# EAGLE design DC27-bottom (EAGLE 9.4.2)

## Sheet 1 of 4
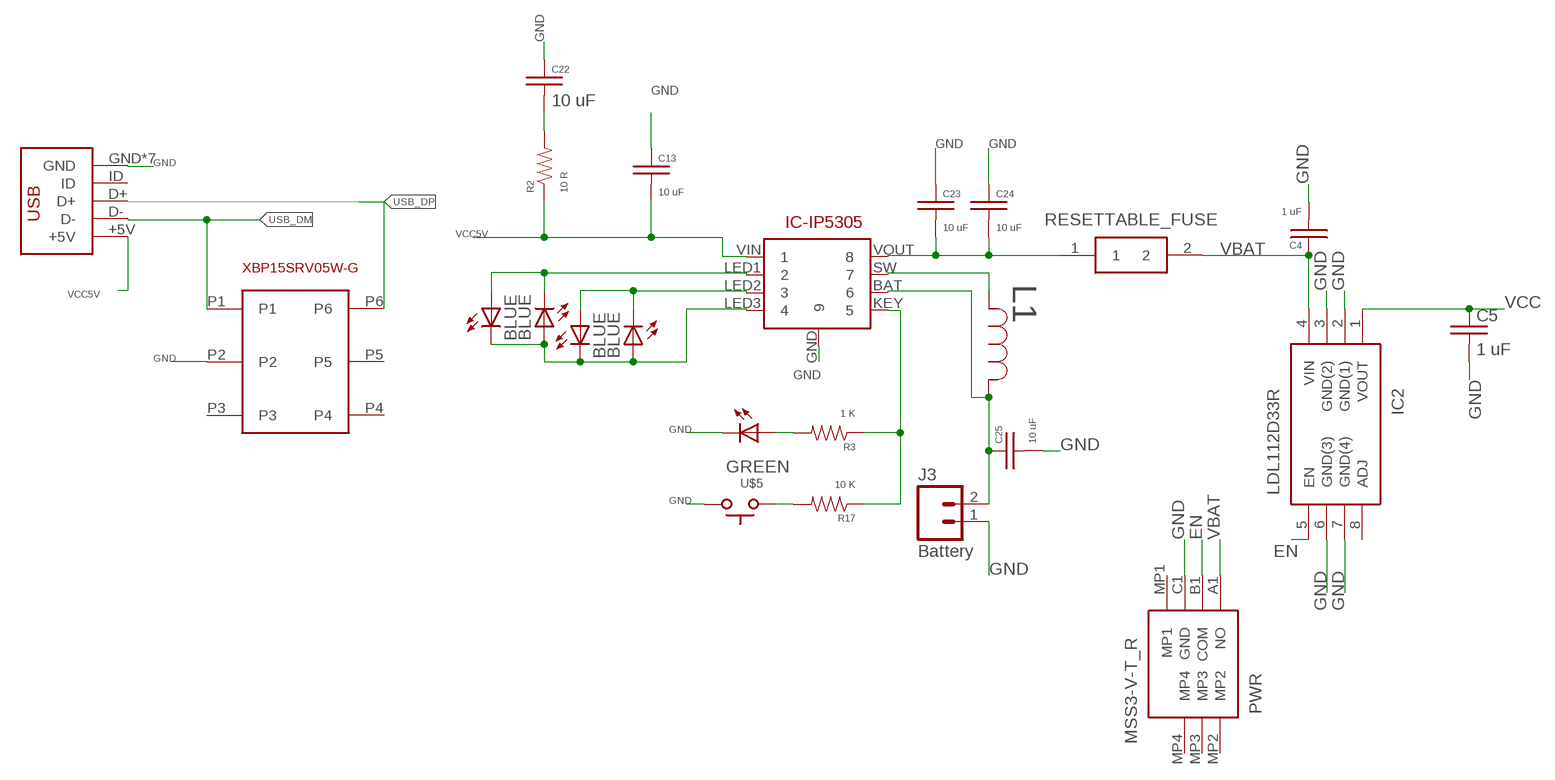
[diagram p0: schematic, sheet 1]

### Parts
C4  1 uF  C-USC0805  [C0805]
C5  1 uF  C-USC0805  [C0805]
C13  10 uF  C-USC0805  [C0805]
C22  10 uF  C-USC0805  [C0805]
C23  10 uF  C-USC0805  [C0805]
C24  10 uF  C-USC0805  [C0805]
C25  10 uF  C-USC0805  [C0805]
CL1  BLUE  LED1206  [LED-1206]
CL2  BLUE  LED1206  [LED-1206]
CL3  BLUE  LED1206  [LED-1206]
CL4  BLUE  LED1206  [LED-1206]
IC2  LDL112D33R  [SOIC127P600X175-8N]
IC-IP5305  IP5305ESOP8  [SOIC127P600X165-8]
J3  Battery  M02JST-PTH-2  [JST-2-PTH]
KEYLED  GREEN  LED1206  [LED-1206]
L1  2.2uH  NRS4018T2R2MDGJ  [IND_TAIYO_NRS4018]
PWR  MSS3-V-T_R  [MSS3VTR]
R2  10 R  RESISTOR0805-RES  [0805]
R3  1 K  RESISTOR0805-RES  [0805]
R17  10 K  RESISTOR0805-RES  [0805]
RESETTABLE_FUSE  0ZCJ0050FF2G  [FUSC3216X55N]
U$2  XBP15SRV05W-G  [SOT-26P-XBP15SRV05W-G]
U$3  DX4R005JJ2DX4R005JJ2  [DX4R005JJ2]
U$5  SWITCH_TACTILETACTILE-2PIN-NARROW  [TACTILE-2PIN-NARROW]

### Nets
EN: IC2.5(EN) PWR.B1(COM) ; also sheet 2
GND: C4.2 C5.2 C13.1 C22.1 C23.1 C24.1 C25.2 IC2.2(GND(1)) IC2.3(GND(2)) IC2.6(GND(3)) IC2.7(GND(4)) IC-IP5305.GND J3.1 KEYLED.C PWR.C1(GND) U$2.P2 U$3.GND U$3.P$6(GND) U$3.P$7(GND) U$3.P$8(GND) U$3.P$9(GND) U$3.P$10(GND) U$3.P$11(GND) U$5.P$1(A) ; also sheet 2,3
N$5: CL1.A CL2.C IC-IP5305.LED1
N$14: CL3.A CL4.C IC-IP5305.LED2
N$15: CL1.C CL2.A CL3.C CL4.A IC-IP5305.LED3
N$16: C22.2 R2.2
N$17: IC-IP5305.SW L1.2
N$20: C25.1 IC-IP5305.BAT J3.2 L1.1
N$21: IC-IP5305.KEY R3.1 R17.1
N$24: KEYLED.A R3.2
N$25: R17.2 U$5.P$2(C)
N$27: C23.2 C24.2 IC-IP5305.VOUT RESETTABLE_FUSE.1
USB_DM: U$2.P1 U$3.D- ; also sheet 3
USB_DP: U$2.P6 U$3.D+ ; also sheet 3
VBAT [5v]: C4.1 IC2.4(VIN) PWR.A1(NO) RESETTABLE_FUSE.2
VCC: C5.1 IC2.1(VOUT) ; also sheet 2,3
VCC5V [5v]: C13.2 IC-IP5305.VIN R2.1 U$3.+5V ; also sheet 3
Unconnected: IC2.8(ADJ) PWR.MP1 PWR.MP2 PWR.MP3 PWR.MP4 U$2.P3 U$2.P4 U$2.P5 U$3.ID

## Sheet 2 of 4
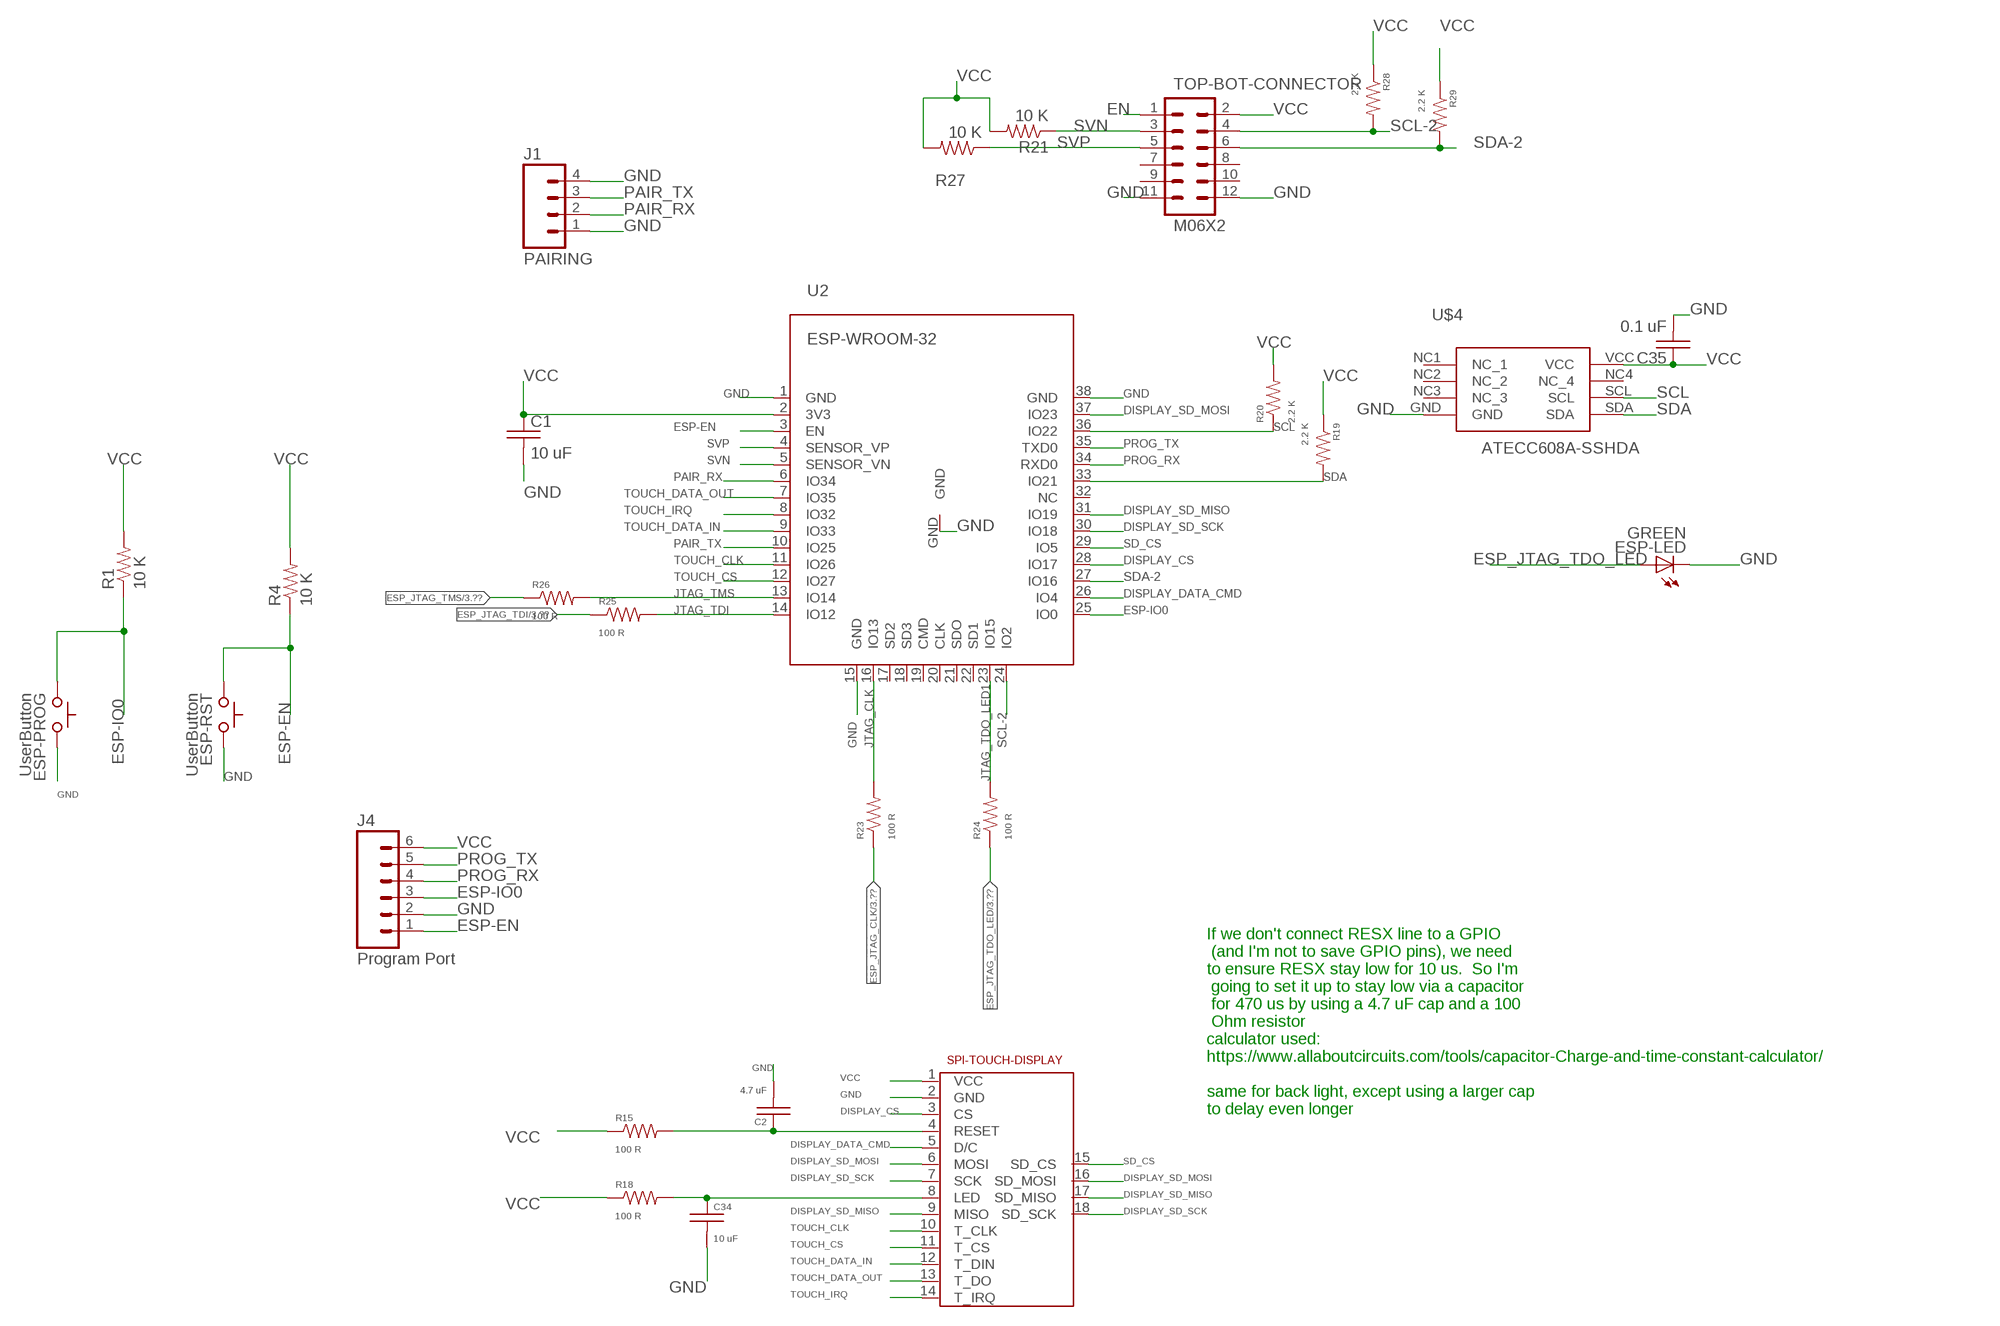
[diagram p1: schematic, sheet 2]

### Parts
C1  10 uF  C-USC0805  [C0805]
C2  4.7 uF  C-USC0805  [C0805]
C34  10 uF  C-USC0805  [C0805]
C35  0.1 uF  C-USC0805  [C0805]
ESP-LED  GREEN  LED1206  [LED-1206]
ESP-PROG  UserButton  SWITCH_TACTILETACTILE-2PIN-NARROW  [TACTILE-2PIN-NARROW]
ESP-RST  UserButton  SWITCH_TACTILETACTILE-2PIN-NARROW  [TACTILE-2PIN-NARROW]
J1  PAIRING  M04PTH  [1X04]
J4  Program Port  M06POGO-PIN  [1X06-SMD-POGO]
R1  10 K  RESISTOR0805-RES  [0805]
R4  10 K  RESISTOR0805-RES  [0805]
R15  100 R  RESISTOR0805-RES  [0805]
R18  100 R  RESISTOR0805-RES  [0805]
R19  2.2 K  RESISTOR0805-RES  [0805]
R20  2.2 K  RESISTOR0805-RES  [0805]
R21  10 K  RESISTOR0805-RES  [0805]
R23  100 R  RESISTOR0805-RES  [0805]
R24  100 R  RESISTOR0805-RES  [0805]
R25  100 R  RESISTOR0805-RES  [0805]
R26  100 R  RESISTOR0805-RES  [0805]
R27  10 K  RESISTOR0805-RES  [0805]
R28  2.2 K  RESISTOR0805-RES  [0805]
R29  2.2 K  RESISTOR0805-RES  [0805]
TOP-BOT-CONNECTOR  M06X2  [2X6]
U2  ESP-WROOM-32  [ESP-WROOM-32]
U$4  ATECC608A-SSHDA  [8-SOIC]
U$10  2.4-SPI-TFT-TOUCH-SSD-MODULE  [2.4-SPI-TFT-TOUCH-SSD-MODULE]

### Nets
DISPLAY_BACKLIT: C34.1 R18.2 U$10.8(LED)
DISPLAY_CS: U2.28(IO17) U$10.3(CS)
DISPLAY_DATA_CMD: U2.26(IO4) U$10.5(D/C)
DISPLAY_RESET: C2.1 R15.2 U$10.4(RESET)
DISPLAY_SD_MISO: U2.31(IO19) U$10.9(MISO) U$10.17(SD_MISO)
DISPLAY_SD_MOSI: U2.37(IO23) U$10.6(MOSI) U$10.16(SD_MOSI)
DISPLAY_SD_SCK: U2.30(IO18) U$10.7(SCK) U$10.18(SD_SCK)
EN: TOP-BOT-CONNECTOR.1 ; also sheet 1
ESP-EN: ESP-RST.P$2(C) J4.1 R4.1 U2.3(EN)
ESP-IO0: ESP-PROG.P$2(C) J4.3 R1.1 U2.25(IO0)
ESP_JTAG_CLK: R23.1 ; also sheet 3
ESP_JTAG_TDI: R25.1 ; also sheet 3
ESP_JTAG_TDO_LED: ESP-LED.A R24.1 ; also sheet 3
ESP_JTAG_TMS: R26.1 ; also sheet 3
GND: C1.2 C2.2 C34.2 C35.2 ESP-LED.C ESP-PROG.P$1(A) ESP-RST.P$1(A) J1.1 J1.4 J4.2 TOP-BOT-CONNECTOR.11 TOP-BOT-CONNECTOR.12 U2.1(GND) U2.15(GND) U2.38(GND) U2.GND U$4.GND U$10.2(GND) ; also sheet 1,3
JTAG_CLK: R23.2 U2.16(IO13)
JTAG_TDI: R25.2 U2.14(IO12)
JTAG_TDO_LED1: R24.2 U2.23(IO15)
JTAG_TMS: R26.2 U2.13(IO14)
PAIR_RX: J1.2 U2.6(IO34)
PAIR_TX: J1.3 U2.10(IO25)
PROG_RX: J4.4 U2.34(RXD0) ; also sheet 3
PROG_TX: J4.5 U2.35(TXD0) ; also sheet 3
SCL: R20.1 U2.36(IO22) U$4.SCL
SCL-2: R28.2 TOP-BOT-CONNECTOR.4 U2.24(IO2)
SD_CS: U2.29(IO5) U$10.15(SD_CS)
SDA: R19.2 U2.33(IO21) U$4.SDA
SDA-2: R29.2 TOP-BOT-CONNECTOR.6 U2.27(IO16)
SVN: R21.1 TOP-BOT-CONNECTOR.3 U2.5(SENSOR_VN)
SVP: R27.1 TOP-BOT-CONNECTOR.5 U2.4(SENSOR_VP)
TOUCH_CLK: U2.11(IO26) U$10.10(T_CLK)
TOUCH_CS: U2.12(IO27) U$10.11(T_CS)
TOUCH_DATA_IN: U2.9(IO33) U$10.12(T_DIN)
TOUCH_DATA_OUT: U2.7(IO35) U$10.13(T_DO)
TOUCH_IRQ: U2.8(IO32) U$10.14(T_IRQ)
VCC: C1.1 C35.1 J4.6 R1.2 R4.2 R15.1 R18.1 R19.1 R20.2 R21.2 R27.2 R28.1 R29.1 TOP-BOT-CONNECTOR.2 U2.2(3V3) U$4.VCC U$10.1(VCC) ; also sheet 1,3
Unconnected: TOP-BOT-CONNECTOR.7 TOP-BOT-CONNECTOR.8 TOP-BOT-CONNECTOR.9 TOP-BOT-CONNECTOR.10 U2.17(SD2) U2.18(SD3) U2.19(CMD) U2.20(CLK) U2.21(SDO) U2.22(SD1) U2.32(NC) U$4.NC1(NC_1) U$4.NC2(NC_2) U$4.NC3(NC_3) U$4.NC4(NC_4)

### Notes on the sheet
- If we don't connect RESX line to a GPIO
   (and I'm not to save GPIO pins), we need 
  to ensure RESX stay low for 10 us.  So I'm
   going to set it up to stay low via a capacitor
   for 470 us by using a 4.7 uF cap and a 100
   Ohm resistor
  calculator used:
  https://www.allaboutcircuits.com/tools/capacitor-Charge-and-time-constant-calculator/
  
  same for back light, except using a larger cap 
  to delay even longer

## Sheet 3 of 4
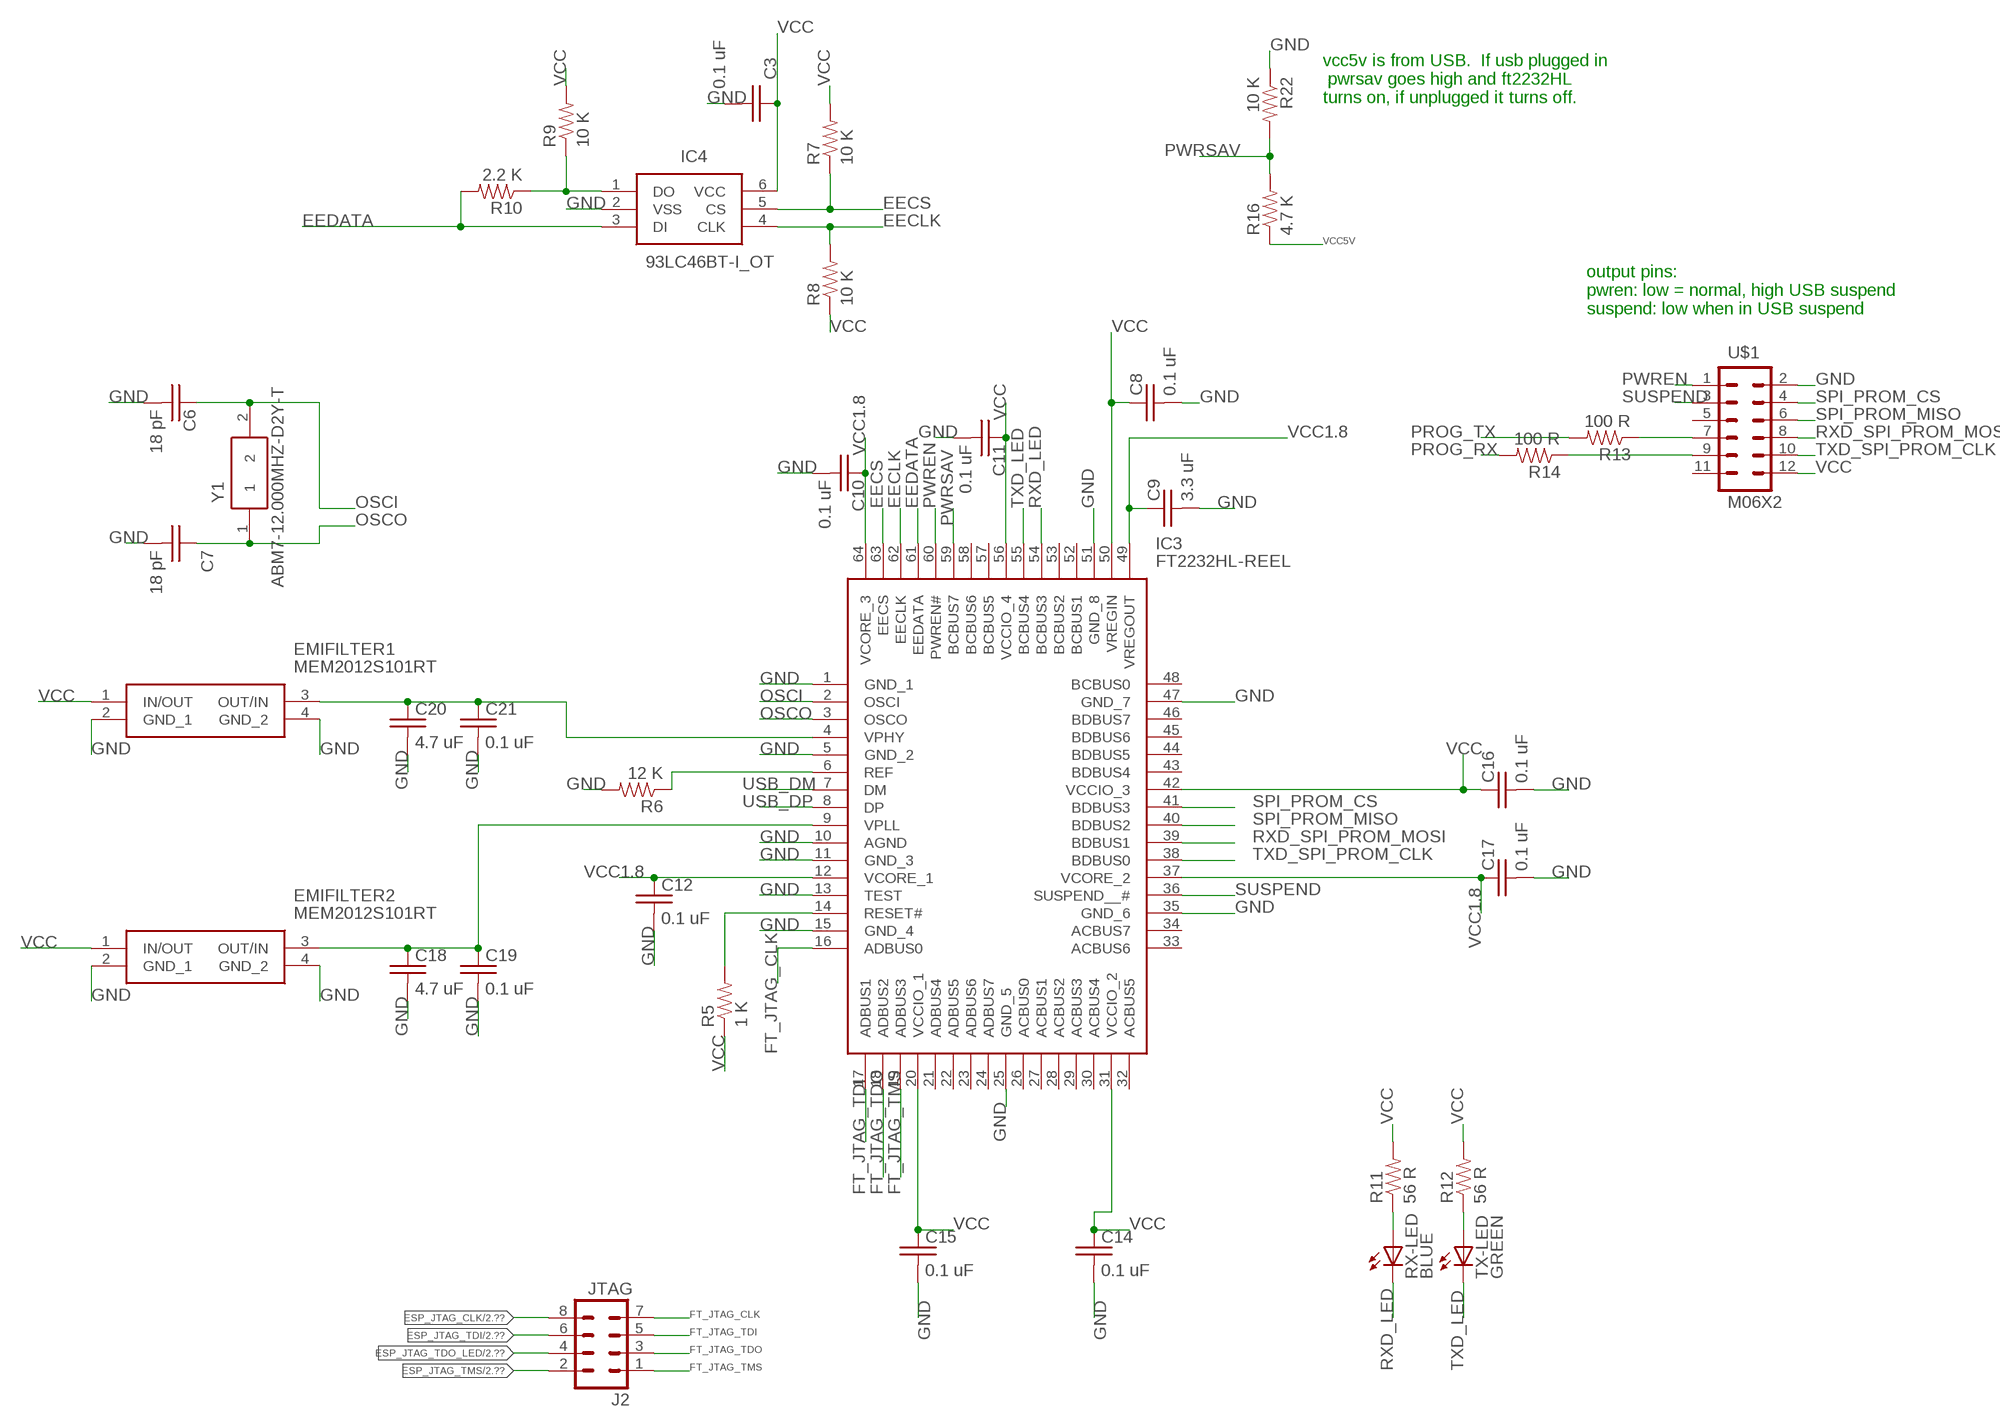
[diagram p2: schematic, sheet 3]

### Parts
C3  0.1 uF  C-USC0805  [C0805]
C6  18 pF  C-USC0805  [C0805]
C7  18 pF  C-USC0805  [C0805]
C8  0.1 uF  C-USC0805  [C0805]
C9  3.3 uF  C-USC0805  [C0805]
C10  0.1 uF  C-USC0805  [C0805]
C11  0.1 uF  C-USC0805  [C0805]
C12  0.1 uF  C-USC0805  [C0805]
C14  0.1 uF  C-USC0805  [C0805]
C15  0.1 uF  C-USC0805  [C0805]
C16  0.1 uF  C-USC0805  [C0805]
C17  0.1 uF  C-USC0805  [C0805]
C18  4.7 uF  C-USC0805  [C0805]
C19  0.1 uF  C-USC0805  [C0805]
C20  4.7 uF  C-USC0805  [C0805]
C21  0.1 uF  C-USC0805  [C0805]
EMIFILTER1  MEM2012S101RT  [MEM2012S101RT]
EMIFILTER2  MEM2012S101RT  [MEM2012S101RT]
IC3  FT2232HL-REEL  [QFP50P1200X1200X160-64N]
IC4  93LC46BT-I_OT  [SOT95P270X145-6N]
J2  JTAG  M04X2  [2X4]
R5  1 K  RESISTOR0805-RES  [0805]
R6  12 K  RESISTOR0805-RES  [0805]
R7  10 K  RESISTOR0805-RES  [0805]
R8  10 K  RESISTOR0805-RES  [0805]
R9  10 K  RESISTOR0805-RES  [0805]
R10  2.2 K  RESISTOR0805-RES  [0805]
R11  56 R  RESISTOR0805-RES  [0805]
R12  56 R  RESISTOR0805-RES  [0805]
R13  100 R  RESISTOR0805-RES  [0805]
R14  100 R  RESISTOR0805-RES  [0805]
R16  4.7 K  RESISTOR0805-RES  [0805]
R22  10 K  RESISTOR0805-RES  [0805]
RX-LED  BLUE  LED1206  [LED-1206]
TX-LED  GREEN  LED1206  [LED-1206]
U$1  M06X2  [2X6]
Y1  ABM7-12.000MHZ-D2Y-T  [ABM7]

### Nets
EECLK: IC3.62(EECLK) IC4.4(CLK) R8.2
EECS: IC3.63(EECS) IC4.5(CS) R7.1
EEDATA: IC3.61(EEDATA) IC4.3(DI) R10.2
ESP_JTAG_CLK: J2.8 ; also sheet 2
ESP_JTAG_TDI: J2.6 ; also sheet 2
ESP_JTAG_TDO_LED: J2.4 ; also sheet 2
ESP_JTAG_TMS: J2.2 ; also sheet 2
FT_JTAG_CLK: IC3.16(ADBUS0) J2.7
FT_JTAG_TDI: IC3.17(ADBUS1) J2.5
FT_JTAG_TDO: IC3.18(ADBUS2) J2.3
FT_JTAG_TMS: IC3.19(ADBUS3) J2.1
GND: C3.2 C6.2 C7.2 C8.2 C9.2 C10.2 C11.2 C12.2 C14.2 C15.2 C16.2 C17.2 C18.2 C19.2 C20.2 C21.2 EMIFILTER1.2(GND_1) EMIFILTER1.4(GND_2) EMIFILTER2.2(GND_1) EMIFILTER2.4(GND_2) IC3.1(GND_1) IC3.5(GND_2) IC3.10(AGND) IC3.11(GND_3) IC3.13(TEST) IC3.15(GND_4) IC3.25(GND_5) IC3.35(GND_6) IC3.47(GND_7) IC3.51(GND_8) IC4.2(VSS) R6.2 R22.1 U$1.2 ; also sheet 1,2
N$6: IC3.14(RESET#) R5.2
N$7: IC3.6(REF) R6.1
N$8: IC4.1(DO) R9.1 R10.1
N$11: R11.1 RX-LED.A
N$13: R12.1 TX-LED.A
N$18: C18.1 C19.1 EMIFILTER2.3(OUT/IN) IC3.9(VPLL)
N$19: C20.1 C21.1 EMIFILTER1.3(OUT/IN) IC3.4(VPHY)
N$31: R14.1 U$1.9
N$32: R13.1 U$1.7
OSCI: C6.1 IC3.2(OSCI) Y1.2
OSCO: C7.1 IC3.3(OSCO) Y1.1
PROG_RX: R14.2 ; also sheet 2
PROG_TX: R13.2 ; also sheet 2
PWREN: IC3.60(PWREN#) U$1.1
PWRSAV: IC3.59(BCBUS7) R16.2 R22.2
RXD_LED: IC3.54(BCBUS3) RX-LED.C
RXD_SPI_PROM_MOSI: IC3.39(BDBUS1) U$1.8
SPI_PROM_CS: IC3.41(BDBUS3) U$1.4
SPI_PROM_MISO: IC3.40(BDBUS2) U$1.6
SUSPEND: IC3.36(SUSPEND__#) U$1.3
TXD_LED: IC3.55(BCBUS4) TX-LED.C
TXD_SPI_PROM_CLK: IC3.38(BDBUS0) U$1.10
USB_DM: IC3.7(DM) ; also sheet 1
USB_DP: IC3.8(DP) ; also sheet 1
VCC: C3.1 C8.1 C11.1 C14.1 C15.1 C16.1 EMIFILTER1.1(IN/OUT) EMIFILTER2.1(IN/OUT) IC3.20(VCCIO_1) IC3.31(VCCIO_2) IC3.42(VCCIO_3) IC3.50(VREGIN) IC3.56(VCCIO_4) IC4.6(VCC) R5.1 R7.2 R8.1 R9.2 R11.2 R12.2 U$1.12 ; also sheet 1,2
VCC1.8: C9.1 C10.1 C12.1 C17.1 IC3.12(VCORE_1) IC3.37(VCORE_2) IC3.49(VREGOUT) IC3.64(VCORE_3)
VCC5V [5v]: R16.1 ; also sheet 1
Unconnected: IC3.21(ADBUS4) IC3.22(ADBUS5) IC3.23(ADBUS6) IC3.24(ADBUS7) IC3.26(ACBUS0) IC3.27(ACBUS1) IC3.28(ACBUS2) IC3.29(ACBUS3) IC3.30(ACBUS4) IC3.32(ACBUS5) IC3.33(ACBUS6) IC3.34(ACBUS7) IC3.43(BDBUS4) IC3.44(BDBUS5) IC3.45(BDBUS6) IC3.46(BDBUS7) IC3.48(BCBUS0) IC3.52(BCBUS1) IC3.53(BCBUS2) IC3.57(BCBUS5) IC3.58(BCBUS6) U$1.5 U$1.11

### Notes on the sheet
- vcc5v is from USB.  If usb plugged in
   pwrsav goes high and ft2232HL 
  turns on, if unplugged it turns off.
- output pins:
  pwren: low = normal, high USB suspend
  suspend: low when in USB suspend

## Sheet 4 of 4
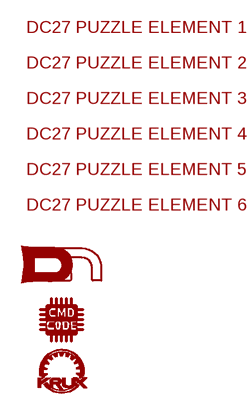
[diagram p3: schematic, sheet 4]

### Parts
U$6  DC27_PUZZLE_ELEMENT_1  [DC27_PUZZLE_ELEMENT_1]
U$7  KRUX_LOGO  [KRUX_LOGO]
U$8  CMD_C0DE_LOGO  [CMD_C0DE_LOGO]
U$9  DN_LOGODC26  [DN_LOGO_DC26]
U$11  DC27_PUZZLE_ELEMENT_2  [DC27_PUZZLE_ELEMENT_2]
U$12  DC27_PUZZLE_ELEMENT_3  [DC27_PUZZLE_ELEMENT_3]
U$13  DC27_PUZZLE_ELEMENT_4  [DC27_PUZZLE_ELEMENT_4]
U$14  DC27_PUZZLE_ELEMENT_5  [DC27_PUZZLE_ELEMENT_5]
U$15  DC27_PUZZLE_ELEMENT_6  [DC27_PUZZLE_ELEMENT_6]

## Library data of the parts
C1-C25 C34 C35 = passives:C-US: CAPACITOR, American symbol
CL1-CL4 ESP-LED KEYLED RX-LED TX-LED = leds:LED: LEDs Standard schematic elements and footprints for 5mm, 3mm, 1206, and 0603 sized LEDs. 5mm - Spark Fun Electronics SKU : COM-00529 (and others)
EMIFILTER1 EMIFILTER2 = passives:MEM2012S101RT: EMI Filter Circuits Source: Datasheet; DESCRIPTION: EMI Filter Circuits; HEIGHT: 1mm; MANUFACTURER_NAME: TDK; MANUFACTURER_PART_NUMBER: MEM2012S101RT; MOUSER_PART_NUMBER: N/A
ESP-PROG ESP-RST = dc-26:SWITCH_TACTILE
IC2 = voltage-regulator:LDL112D33R: LDO Voltage Regulators 1.2 A low quiescent current LDO with reverse current protection Source: Datasheet; ARROW_PART_NUMBER: LDL112D33R; ARROW_PRICE/STOCK: https://www.arrow.com/en/products/ldl112d33r/stmicroelectronics; DESCRIPTION: LDO Voltage Regulators 1.2 A low quiescent current LDO with reverse current protection; HEIGHT: 1.75mm; MANUFACTURER_NAME: STMicroelectronics; MANUFACTURER_PART_NUMBER: LDL112D33R
IC3 = ICs:FT2232HL-REEL: FTDI Chip FT2232HL-REEL, USB Controller, 4-channel, 480MBps, USB 2.0, 64-Pin LQFP Source: Datasheet; DESCRIPTION: FTDI Chip FT2232HL-REEL, USB Controller, 4-channel, 480MBps, USB 2.0, 64-Pin LQFP; HEIGHT: 1.6mm; MANUFACTURER_NAME: FTDI Chip; MANUFACTURER_PART_NUMBER: FT2232HL-REEL; MOUSER_PART_NUMBER: 895-FT2232HL
IC4 = eeprom:93LC46BT-I_OT: 1K,64 X 16 Serial EE,SOT23 Source: Datasheet; DESCRIPTION: 1K,64 X 16 Serial EE,SOT23; HEIGHT: 1.45mm; MANUFACTURER_NAME: Microchip; MANUFACTURER_PART_NUMBER: 93LC46BT-I/OT; MOUSER_PART_NUMBER: 579-93LC46BT-I/OT
IC-IP5305 = charging-ic:IP5305: IP5305
J1 = connector:M04: Header 4 Standard 4-pin 0.1" header. Use with straight break away headers (SKU : PRT-00116), right angle break away headers (PRT-00553), swiss pins (PRT-00743), machine pins (PRT-00117), and female headers (PRT-00115). Molex polarized connector foot print use with SKU : PRT-08231 with associated crimp pins and housings. 1MM SMD Version SKU: PRT-10208; PROD_ID: CONN-09696
J2 = connector:M04X2: .1" header, two rows of four.
J3 = connector:M02: Standard 2-pin 0.1" header. Use with - straight break away headers ( PRT-00116) - right angle break away headers (PRT-00553) - swiss pins (PRT-00743) - machine pins (PRT-00117) - female headers (PRT-00115) Molex polarized connector foot print use with: PRT-08233 with associated crimp pins and housings. 2.54_SCREWTERM for use with PRT-10571. 3.5mm Screw Terminal footprints for PRT-08084 5mm Screw Terminal footprints for use with PRT-08432; PROD_ID: CONN-09863; SKU: PRT-09914
J4 = connector:M06: Header 6 Standard 6-pin 0.1" header. Use with straight break away headers (SKU : PRT-00116), right angle break away headers (PRT-00553), swiss pins (PRT-00743), machine pins (PRT-00117), and female headers (PRT-00115). Molex polarized connector foot print use with SKU : PRT-08094 with associated crimp pins and housings. NOTES ON THE VARIANTS LOCK and LOCK_LONGPADS... This footprint was designed to help hold the alignment of a through-hole component (i.e. 6-pin header) while soldering it into place. You may notice that each hole has been shifted either up or down by 0.005 of an inch from it's more standard position (which is a perfectly straight line). This slight alteration caused the pins (the squares in the middle) to touch the edges of the holes. Because they are alternating, it causes a "brace" to hold the component in place. 0.005 has proven to be the perfect amount of "off-center" position when using our standard breakaway headers. Although looks a little odd when you look at the bare footprint, once you have a header in there, the alteration is very hard to notice. Also,if you push a header all the way into place, it is covered up entirely on the bottom side. This idea of altering the position of holes to aid alignment will be further integrated into the Sparkfun Library for other footprints. It can help hold any component with 3 or more connection pins.
L1 = passives:NRS4018T2R2MDGJ: Inductor: CD43; MANUFACTURER_PART_NUMBER: NRS4018T2R2MDGJ; VENDOR: TAIYO YUDEN
PWR = switches:MSS3-V-T_R: Slide Switches Slide Type 1P2T (1.4mm height) Source: Datasheet; DESCRIPTION: Slide Switches Slide Type 1P2T (1.4mm height); HEIGHT: 1.4mm; MANUFACTURER_NAME: Diptronics; MANUFACTURER_PART_NUMBER: MSS3-V-T/R; MOUSER_PART_NUMBER: 113-MSS3-V-T/R; MOUSER_PRICE-STOCK: https://www.mouser.com/Search/Refine.aspx?Keyword=113-MSS3-V-T%2FR
R1 R4 R15 R18-R21 R23-R29 = dc-26:RESISTOR: Resistor Basic schematic elements and footprints for 0603, 1206, and PTH resistors.
R2 R3 R5-R14 R16 R17 R22 = passives:RESISTOR: Resistor Basic schematic elements and footprints for 0603, 1206, and PTH resistors.
RESETTABLE_FUSE = passives:0ZCJ0050FF2G: Resettable Fuses - PPTC <https://componentsearchengine.com/Images/9/0ZCJ0050FF2G.jpg> Source: Datasheet <https://www.belfuse.com/resources/CircuitProtection/datasheets/0ZCJ Nov2016.pdf>; DESCRIPTION: Resettable Fuses - PPTC; HEIGHT: 0.55mm; MANUFACTURER_NAME: Bel-Stewart; MANUFACTURER_PART_NUMBER: 0ZCJ0050FF2G; SUPPLIER_NAME: RS
TOP-BOT-CONNECTOR U$1 = connector:M06X2
U2 = ICs:ESP-WROOM-32
U$2 = passives:XBP15SRV05W-G: Low Capacitance TVS Diode Array (used for USB) P1->D- (usb1) P2->GND P3->D- (usb2) P4->D+ (usb2) P5->NC P6->D+(usb1) Datasheet; DIGI_KEY_PART_NUMBER: 893-1422-1-ND; MANUFACTURER_PART_NUMBER: XBP15SRV05W-G
U$3 = connector:DX4R005JJ2
U$4 = ICs:ATECC608A-SSHDA
U$5 = switches:SWITCH_TACTILE
U$6 = darknet_parts_library:DC27_PUZZLE_ELEMENT_1
U$7 = logos:KRUX_LOGO
U$8 = logos:CMD_C0DE_LOGO
U$9 = darknet_parts_library:DN_LOGO
U$10 = displays:2.4-SPI-TFT-TOUCH-SSD-MODULE: 2.4" SPI TFT Module Driver: ILI9341 DOTS: 240x320 Touch: YES
U$11 = darknet_parts_library:DC27_PUZZLE_ELEMENT_2
U$12 = darknet_parts_library:DC27_PUZZLE_ELEMENT_3
U$13 = darknet_parts_library:DC27_PUZZLE_ELEMENT_4
U$14 = darknet_parts_library:DC27_PUZZLE_ELEMENT_5
U$15 = darknet_parts_library:DC27_PUZZLE_ELEMENT_6
Y1 = crystals-timing:ABM7-12.000MHZ-D2Y-T: ABRACON - ABM7-12.000MHZ-D2Y-T - CRYSTAL, 12MHZ, 18PF, SMD Source: Datasheet; DESCRIPTION: ABRACON - ABM7-12.000MHZ-D2Y-T - CRYSTAL, 12MHZ, 18PF, SMD; HEIGHT: mm; MANUFACTURER_NAME: ABRACON; MANUFACTURER_PART_NUMBER: ABM7-12.000MHZ-D2Y-T; MOUSER_PART_NUMBER: 815-ABM7-12-D2Y-T; MOUSER_PRICE-STOCK: https://www.mouser.com/Search/Refine.aspx?Keyword=815-ABM7-12-D2Y-T; RS_PART_NUMBER: 1710625P; RS_PRICE-STOCK: http://uk.rs-online.com/web/p/products/1710625P

## Net classes
2 5v: width 0.254 mm, drill 0.8 mm, clearance 0.178 mm

## Board
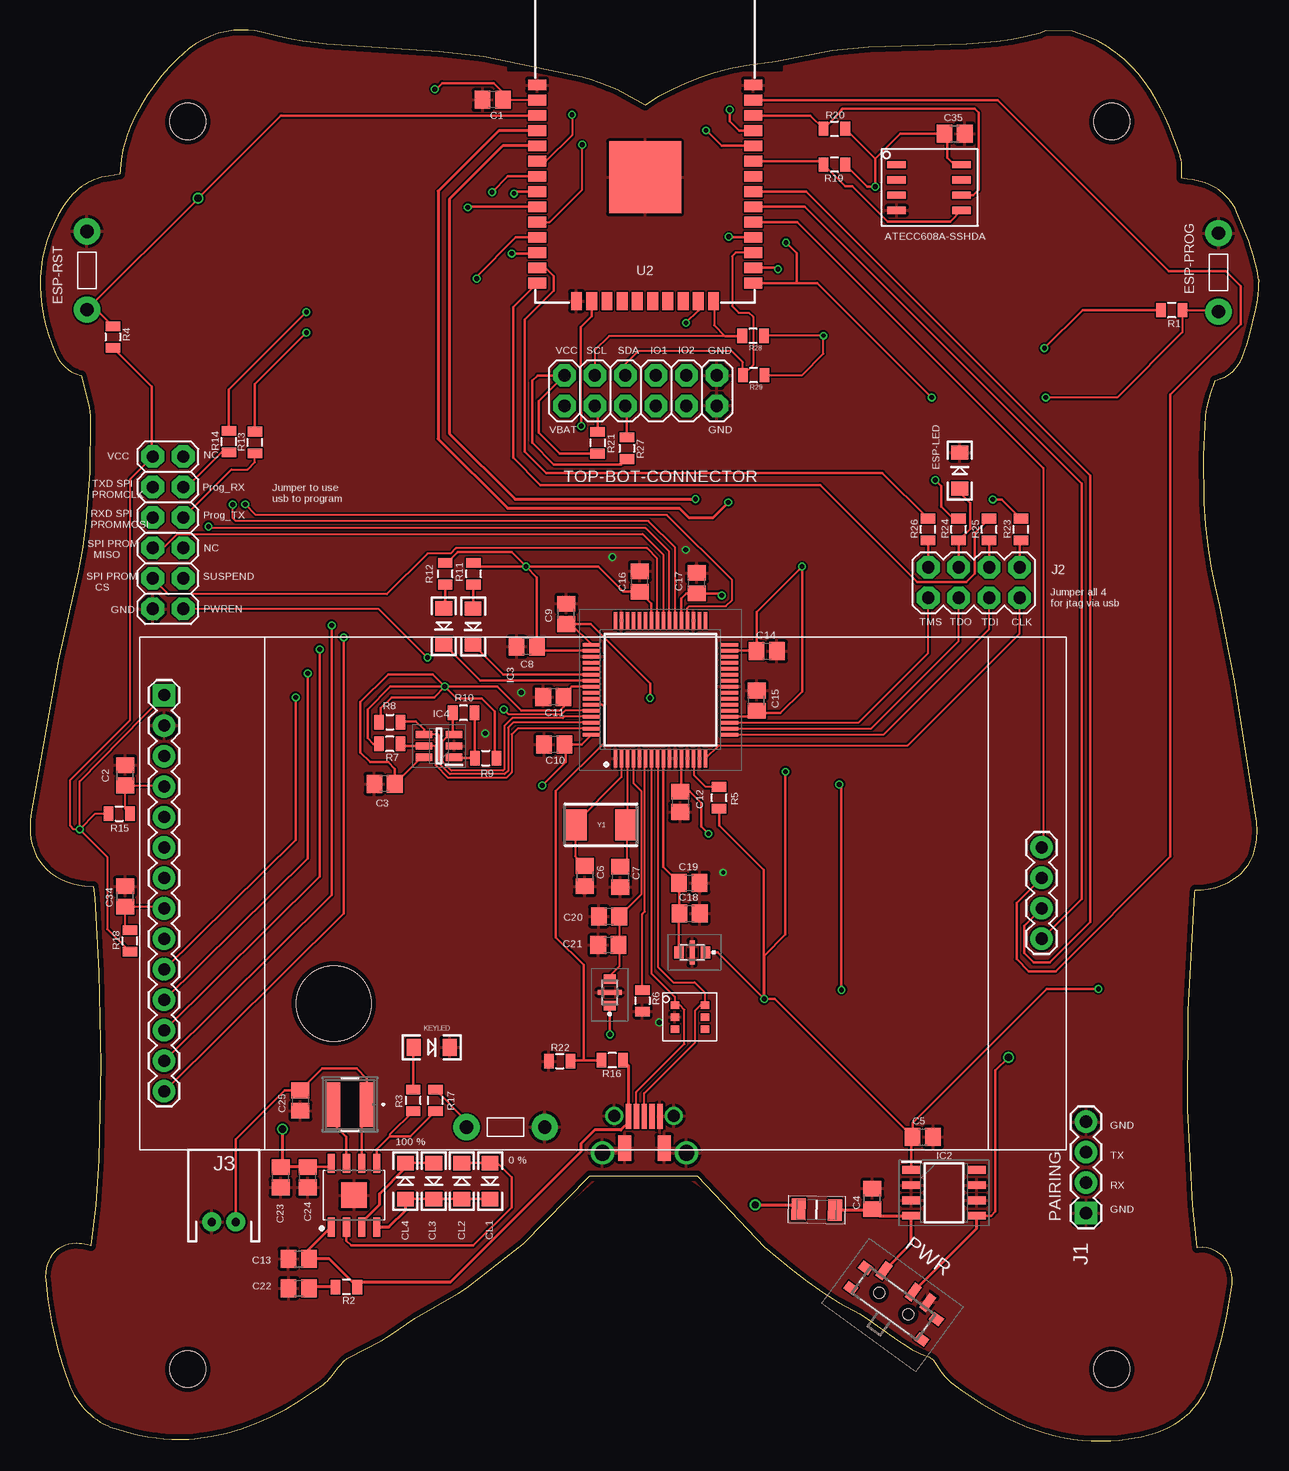
[diagram p4: board, top side]
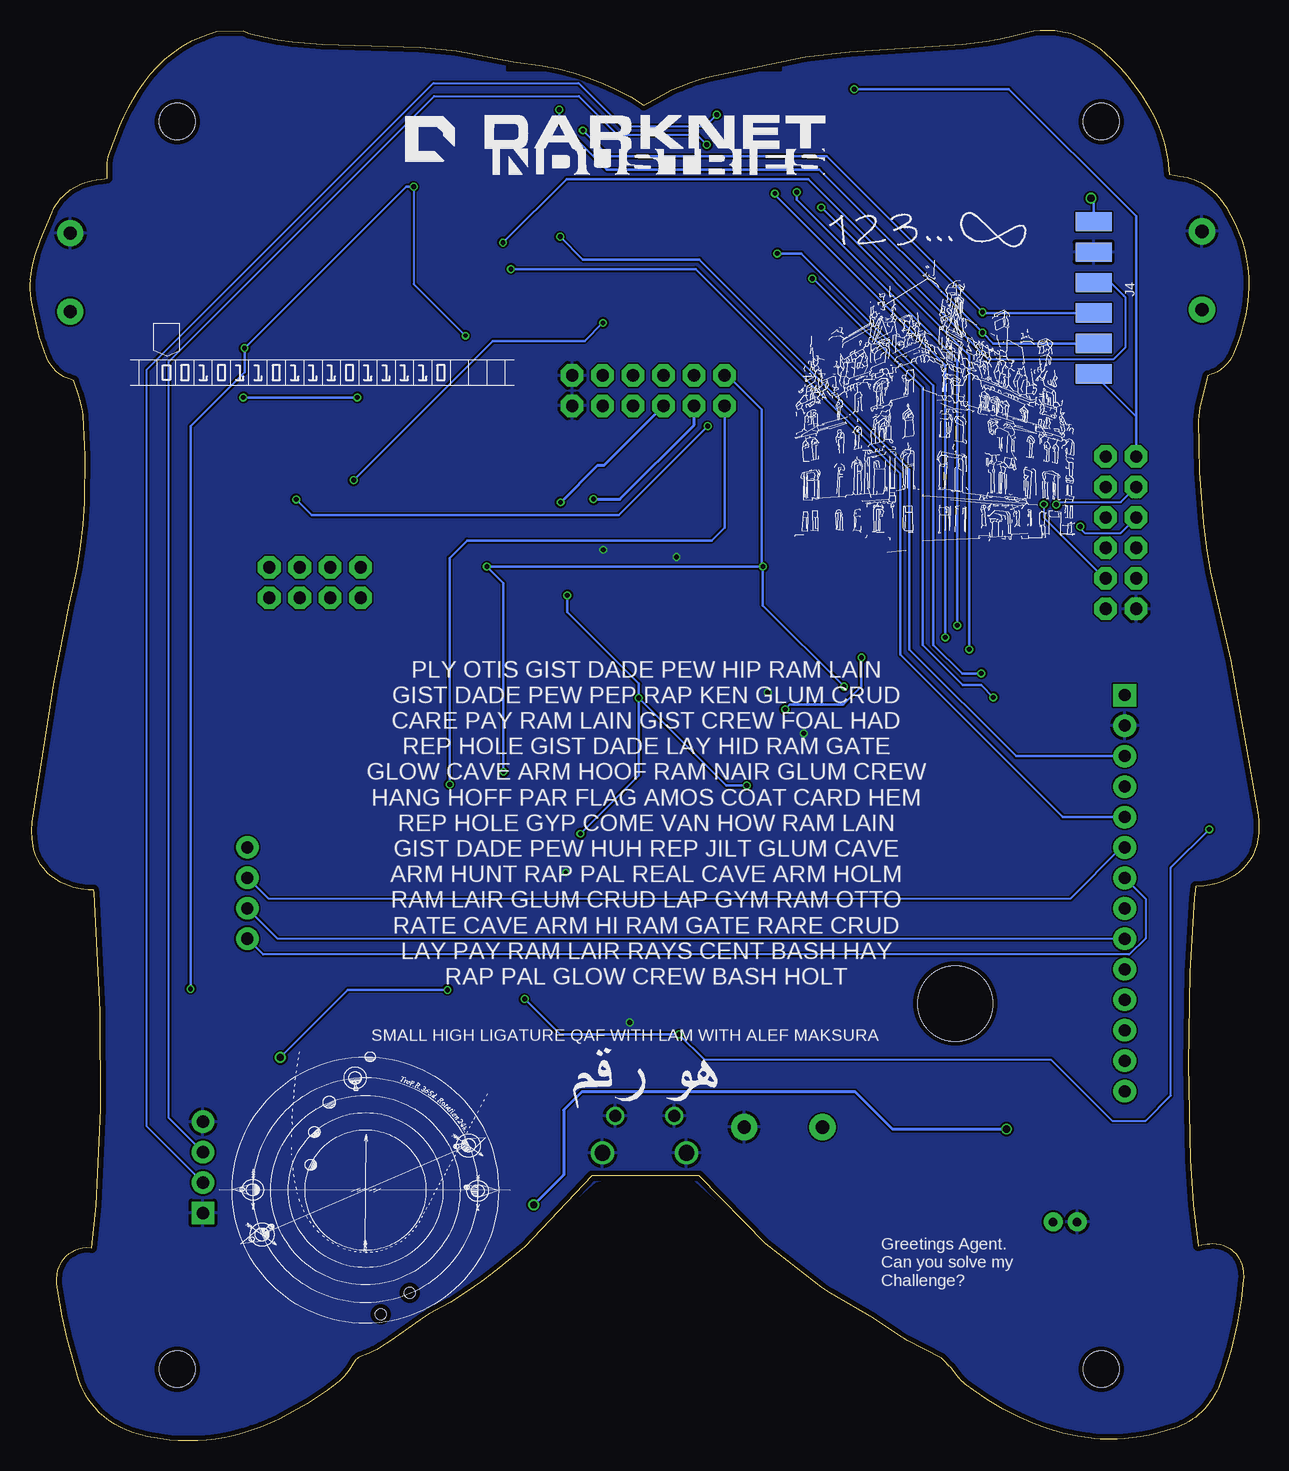
[diagram p5: board, bottom side, seen from below]

Size 102.41 x 117.62 mm. Coordinates in mm from the lower left corner, seen from the top.
Outline: 382 segments
Copper layers (1*16): Top 0.035559375mm / dielectric 1.6mm / Bottom 0.035559375mm
Design rules "oshpark-2layer": minimum track width 6mil, minimum drill 10mil, track to track 6mil, track to pad 6mil, pad to pad 6mil, via to via 6mil, smd to smd 6mil, copper to edge 15mil, drill to drill 6mil, minimum pad ring 5mil, minimum via ring 5mil, stop-mask expansion 2.5mil, vias tented up to drill 0mil, thermal gap 10mil
Holes 3 mm at 13.13,5.99 90.13,5.99 90.13,109.99 13.13,109.99
Holes 6.25 mm at 25.31,36.46

### Footprints (pad centres in the part's own frame; a part is rotated, then mirrored left to right if it is on the bottom)
C0805 = smd 1.3 x 1.5: 1 -0.85,0; 2 0.85,0
LED-1206 = smd 1.2 x 1.4: A -1.5,0; C 1.5,0
MEM2012S101RT = smd 0.8 x 1: 1 -1.1,0; 3 1.1,0 | smd 0.4 x 1: 2 0,-0.5; 4 0,0.5
TACTILE-2PIN-NARROW = drill 1.1 pad 2.184: P$1 3.264,0; P$2 -3.264,0
SOIC127P600X175-8N = smd 1.525 x 0.65: 1 -2.712,1.905; 2 -2.712,0.635; 3 -2.712,-0.635; 4 -2.712,-1.905; 5 2.712,-1.905; 6 2.712,-0.635; 7 2.712,0.635; 8 2.712,1.905
QFP50P1200X1200X160-64N = smd 1.475 x 0.3: 1 -5.738,3.75; 2 -5.738,3.25; 3 -5.738,2.75; 4 -5.738,2.25; 5 -5.738,1.75; 6 -5.738,1.25; 7 -5.738,0.75; 8 -5.738,0.25; 9 -5.738,-0.25; 10 -5.738,-0.75; 11 -5.738,-1.25; 12 -5.738,-1.75; 13 -5.738,-2.25; 14 -5.738,-2.75; 15 -5.738,-3.25; 16 -5.738,-3.75; 33 5.738,-3.75; 34 5.738,-3.25; 35 5.738,-2.75; 36 5.738,-2.25; 37 5.738,-1.75; 38 5.738,-1.25; 39 5.738,-0.75; 40 5.738,-0.25; 41 5.738,0.25; 42 5.738,0.75; 43 5.738,1.25; 44 5.738,1.75; 45 5.738,2.25; 46 5.738,2.75; 47 5.738,3.25; 48 5.738,3.75 | smd 0.3 x 1.475: 17 -3.75,-5.738; 18 -3.25,-5.738; 19 -2.75,-5.738; 20 -2.25,-5.738; 21 -1.75,-5.738; 22 -1.25,-5.738; 23 -0.75,-5.738; 24 -0.25,-5.738; 25 0.25,-5.738; 26 0.75,-5.738; 27 1.25,-5.738; 28 1.75,-5.738; 29 2.25,-5.738; 30 2.75,-5.738; 31 3.25,-5.738; 32 3.75,-5.738; 49 3.75,5.738; 50 3.25,5.738; 51 2.75,5.738; 52 2.25,5.738; 53 1.75,5.738; 54 1.25,5.738; 55 0.75,5.738; 56 0.25,5.738; 57 -0.25,5.738; 58 -0.75,5.738; 59 -1.25,5.738; 60 -1.75,5.738; 61 -2.25,5.738; 62 -2.75,5.738; 63 -3.25,5.738; 64 -3.75,5.738
SOT95P270X145-6N = smd 1.4 x 0.6: 1 -1.25,0.95; 2 -1.25,0; 3 -1.25,-0.95; 4 1.25,-0.95; 5 1.25,0; 6 1.25,0.95
SOIC127P600X165-8 = smd 1.609 x 0.594: BAT 2.653,-0.635; KEY 2.653,-1.905; LED1 -2.653,0.635; LED2 -2.653,-0.635; LED3 -2.653,-1.905; SW 2.653,0.635; VIN -2.653,1.905; VOUT 2.653,1.905 | smd 2.15 x 2.15: GND 0,0
1X04 = drill 1.016 pad 1.88 square: 1 0,0 | drill 1.016 pad 1.88: 2 2.54,0; 3 5.08,0; 4 7.62,0
2X4 = drill 1.016 pad 1.88 octagon: 1 -3.81,-1.27; 2 -3.81,1.27; 3 -1.27,-1.27; 4 -1.27,1.27; 5 1.27,-1.27; 6 1.27,1.27; 7 3.81,-1.27; 8 3.81,1.27
JST-2-PTH = drill 0.7 pad 1.6: 1 -1,0; 2 1,0
1X06-SMD-POGO = smd 1.6 x 3: 1 -6.35,-0.08; 2 -3.81,-0.08; 3 -1.27,-0.08; 4 1.27,-0.08; 5 3.81,-0.08; 6 6.35,-0.08
IND_TAIYO_NRS4018 = smd 1.194 x 3.708: 1 -1.397,0; 2 1.397,0
MSS3VTR = smd 0.7 x 1.5: A1 -2.25,3.05; B1 0.75,3.05; C1 2.25,3.05 | smd 1 x 0.8: MP1 -3.65,2.35; MP2 -3.65,0.25; MP3 3.65,0.25; MP4 3.65,2.35 | hole 0.9: -1.5,1.3; 1.5,1.3
0805 = smd 0.8 x 1.2: 1 -0.9,0; 2 0.9,0
FUSC3216X55N = smd 1.17 x 1.82: 1 -1.52,0; 2 1.52,0
2X6 = drill 1.016 pad 1.88 octagon: 1 0,0; 2 0,2.54; 3 2.54,0; 4 2.54,2.54; 5 5.08,0; 6 5.08,2.54; 7 7.62,0; 8 7.62,2.54; 9 10.16,0; 10 10.16,2.54; 11 12.7,0; 12 12.7,2.54
ESP-WROOM-32 = smd 0.9 x 1.5: 1 7.7,9; 2 6.43,9; 3 5.16,9; 4 3.89,9; 5 2.62,9; 6 1.35,9; 7 0.08,9; 8 -1.19,9; 9 -2.46,9; 10 -3.73,9; 11 -5,9; 12 -6.27,9; 13 -7.54,9; 14 -8.81,9; 25 -8.81,-9; 26 -7.54,-9; 27 -6.27,-9; 28 -5,-9; 29 -3.73,-9; 30 -2.46,-9; 31 -1.19,-9; 32 0.08,-9; 33 1.35,-9; 34 2.62,-9; 35 3.89,-9; 36 5.16,-9; 37 6.43,-9; 38 7.7,-9 | smd 1.5 x 0.9: 15 -10.3,5.715; 16 -10.3,4.445; 17 -10.3,3.175; 18 -10.3,1.905; 19 -10.3,0.635; 20 -10.3,-0.635; 21 -10.3,-1.905; 22 -10.3,-3.175; 23 -10.3,-4.445; 24 -10.3,-5.715 | smd 6 x 6: GND 0,0
SOT-26P-XBP15SRV05W-G = smd 0.6 x 0.7: P1 -1,-1.25; P2 0,-1.25; P3 1,-1.25; P4 1,1.25; P5 0,1.25; P6 -1,1.25
DX4R005JJ2 = smd 2.1 x 0.45: +5V 0.72,-1.32; D+ 0.72,-0.02; D- 0.72,-0.67; GND 0.72,1.28; ID 0.72,0.63 | smd 2.1 x 1.1: P$6 3.35,1.65; P$8 3.35,-1.65 | drill 1: P$7 0.675,2.45; P$9 0.675,-2.5 | drill 1.3: P$10 3.75,-3.5; P$11 3.75,3.5
8-SOIC = smd 0.6 x 1.55: GND 3.81,0; NC1 0,0; NC2 1.27,0; NC3 2.54,0; NC4 1.27,5.4; SCL 2.54,5.4; SDA 3.81,5.4; VCC 0,5.4
2.4-SPI-TFT-TOUCH-SSD-MODULE = drill 1.016 pad 1.88 square: 1 4.83,2.02 | drill 1.016 pad 1.88: 2 7.37,2.02; 3 9.91,2.02; 4 12.45,2.02; 5 14.99,2.02; 6 17.53,2.02; 7 20.07,2.02; 8 22.61,2.02; 9 25.15,2.02; 10 27.69,2.02; 11 30.23,2.02; 12 32.77,2.02; 13 35.31,2.02; 14 37.85,2.02; 15 17.52,75.14; 16 20.06,75.14; 17 22.6,75.14; 18 25.14,75.14
ABM7 = smd 1.9 x 2.6: 1 -2.15,0; 2 2.15,0

### Placement (x,y rotation side)
C1  38.56,111.8 180 top
C2  7.93,55.49 90 top
C3  29.54,54.78 180 top
C4  70.2,20.19 90 top
C5  74.41,25.34 0 top
C6  46.23,47.08 270 top
C7  49.2,47.01 270 top
C8  41.4,66.22 180 top
C9  44.7,68.95 90 top
C10  43.69,58.06 180 top
C11  43.62,62.02 180 top
C12  54.19,53.29 270 top
C13  22.38,15.19 0 top
C14  61.4,65.84 0 top
C15  60.54,61.71 90 top
C16  50.82,71.65 90 top
C17  55.58,71.51 90 top
C18  54.96,43.99 0 top
C19  54.94,46.54 0 top
C20  48.26,43.73 180 top
C21  48.21,41.34 180 top
C22  22.4,12.74 0 top
C23  20.88,21.99 90 top
C24  23.13,21.99 90 top
C25  22.53,28.38 270 top
C34  7.93,45.39 90 top
C35  77.04,108.98 0 top
CL1  38.33,21.67 270 top
CL2  35.98,21.67 90 top
CL3  33.63,21.67 270 top
CL4  31.28,21.67 90 top
EMIFILTER1  48.3,37.39 90 top
EMIFILTER2  55.18,40.72 180 top
ESP-LED  77.48,80.89 90 top
ESP-PROG  99.05,97.42 90 top
ESP-RST  4.74,97.57 90 top
IC2  76.17,20.69 0 top
IC3  52.54,62.63 90 top
IC4  34.09,57.95 180 top
IC-IP5305  27.01,20.49 90 top
J1  88,19 90 top
J2  78.66,71.56 0 top
J3  16.15,18.26 0 top
J4  13.7,95.3 270 bottom
KEYLED  33.48,32.82 0 top
L1  26.66,28.05 180 top
PWR  71.2,10.4 324 top
R1  95.14,94.27 180 top
R2  26.37,12.84 180 top
R3  31.93,28.4 90 top
R4  6.91,92.03 270 top
R5  57.43,53.62 90 top
R6  51.04,36.69 270 top
R7  29.98,58.11 180 top
R8  29.99,59.93 0 top
R9  37.97,56.93 0 top
R10  36.13,60.7 180 top
R11  36.97,72.29 90 top
R12  34.6,72.29 90 top
R13  18.75,83.24 90 top
R14  16.57,83.3 90 top
R15  7.43,52.29 0 top
R16  48.52,31.75 180 top
R17  33.78,28.39 90 top
R18  8.32,41.69 90 top
R19  67.03,106.39 180 top
R20  67.03,109.39 0 top
R21  47.3,83.21 270 top
R22  44.14,31.66 0 top
R23  82.57,75.99 90 top
R24  77.39,75.99 90 top
R25  79.93,75.99 90 top
R26  74.83,75.99 90 top
R27  49.74,82.75 270 top
R28  60.25,92.12 180 top
R29  60.3,88.85 180 top
RESETTABLE_FUSE  65.55,19.28 358.9 top
RX-LED  36.92,67.9 270 top
TOP-BOT-CONNECTOR  44.53,86.29 0 top
TX-LED  34.48,67.92 270 top
U2  51.25,105.34 90 top
U$1  12.77,69.37 90 top
U$2  55,35.33 270 top
U$3  51.21,27.77 270 top
U$4  72.22,106.39 270 top
U$5  39.63,26.16 0 top
U$6  80.06,88.44 0 bottom
U$7  12.33,12.63 0 bottom
U$8  89.39,12.87 0 bottom
U$9  53.64,108.02 0 bottom
U$10  9.16,67 270 top
U$11  29.01,74.82 0 bottom
U$12  74.44,20.97 0 bottom
U$13  80.86,50.93 0 bottom
U$14  52.5,29.8 0 bottom
U$15  50.94,38.83 0 bottom
Y1  47.58,51.36 180 top

### Tracks (layer width: path | path; a pad name or v marks a point on that pad's centre or on a via)
DISPLAY_BACKLIT
  Top 0.152: R18.2 7.93,42.97 C34.1 11.16,44.54 U$10.8
DISPLAY_CS  (via drill 0.4)
  Top 0.2: U2.28 58.29,100.33 v58.23,100.39
  Bottom 0.2: v58.23,100.39 56.33,98.49 46.63,98.49 29.13,80.99 29.13,65.99 20.24,57.09 U$10.3
DISPLAY_DATA_CMD  (via drill 0.4)
  Top 0.2: U2.26 62.23,97.8 v62.33,97.69
  Bottom 0.2: v62.33,97.69 46.93,97.69 29.89,80.64 29.89,65.54 16.36,52.01 U$10.5
DISPLAY_RESET
  Top 0.152: R15.2 7.93,52.69 C2.1 11.22,54.64 U$10.4
DISPLAY_SD_MISO
  Top 0.2: U2.31 64.68,104.14 88.33,80.49 88.33,43.25 84.97,39.89 83.63,39.89 82.83,40.69 82.83,42.93 U$10.17
  Bottom 0.152: U$10.17 81.75,41.85 U$10.9
DISPLAY_SD_MOSI
  Top 0.2: U$10.16 82.23,44.87 82.23,40.18 83.25,39.16 85.46,39.16 95.03,48.73 95.03,87.23 100.9,93.1 100.9,96.25 99.65,97.5 94.9,97.5 80.64,111.77 U2.37
  Bottom 0.152: U$10.16 84.28,46.94 82.53,45.2 15.73,45.2 11.45,49.47 U$10.6
DISPLAY_SD_SCK
  Top 0.2: U2.30 64.55,102.88 87.63,79.79 87.63,45.19 U$10.18
  Bottom 0.152: U$10.7 9.45,45.2 9.45,41.91 10.82,40.54 82.98,40.54 U$10.18
EECLK
  Top 0.152: IC3.62 40.26,59.88 39.84,59.46 39.84,55.86 39.56,55.58 34.99,55.58 34.1,56.47 34.1,58.83 34.03,58.9 IC4.4
  Top 0.203: R8.2 30.95,59.99 32.13,59.99 32.84,59.29 IC4.4
EECS
  Top 0.152: IC3.63 40.63,59.38 40.14,58.9 40.14,55.74 39.69,55.28 34.87,55.28 33.8,56.35 33.8,57.95 IC4.5
  Top 0.203: R7.1 31.04,57.95 IC4.5
EEDATA
  Top 0.152: IC3.61 44.53,60.38 44.4,60.25 40.2,60.25 39.53,59.59 39.53,55.99 39.43,55.89 35.12,55.89 34.41,56.6 34.41,58.34 35.07,59 35.23,59
  Top 0.203: IC4.3 35.23,59 R10.2
EN  (via drill 0.4, 0.6)
  Top 0.2: IC2.5 80.1,18.79 80.45,19.14 80.45,30.87 v81.55,31.97 | v67.62,37.6 67.62,54.54 v67.44,54.73
  Top 0.254: PWR.B1 78.88,17.71 IC2.5
  Bottom 0.2: v67.62,37.6 75.92,37.6 v81.55,31.97 | v67.44,54.73 67.44,73.62 65.99,75.07 45.59,75.07 44.53,76.13 TOP-BOT-CONNECTOR.1
ESP-EN  (via drill 0.6)
  Top 0.2: R4.1 5.54,94.3 ESP-RST.P$2 14,103.56 v14,103.6 20.89,110.5 20.94,110.5 21,110.5 U2.3
  Bottom 0.2: J4.1 13.78,103.38 v14,103.6
ESP-IO0  (via drill 0.4)
  Top 0.152: v84.63,86.99 90.61,86.99 96.04,92.42 R1.1 98.93,94.27 ESP-PROG.P$2
  Top 0.2: U2.25 63.9,96.53 | 63.9,96.53 65.6,96.53 v75.13,86.99 | v63,99.9 63.9,99 63.9,96.53
  Bottom 0.152: 22.59,90.24 22.55,90.2 12.1,90.2 11.1,91.2 11.1,95.31 11.28,95.48
  Bottom 0.2: v75.13,86.99 v84.63,86.99 | 22.59,90.24 37.55,105.2 57.7,105.2 v63,99.9 | J4.3 12.36,96.57 11.28,95.48
ESP_JTAG_CLK
  Top 0.2: J2.8 82.47,74.99 R23.1
ESP_JTAG_TDI
  Top 0.2: J2.6 R25.1
ESP_JTAG_TDO_LED
  Top 0.2: J2.4 R24.1 78.33,76.04 78.33,78.19 77.48,79.04 ESP-LED.A
ESP_JTAG_TMS
  Top 0.2: J2.2 74.85,75.07 R26.1
FT_JTAG_CLK
  Top 0.152: IC3.16 57.38,57.99 73.13,57.99 82.47,67.33 J2.7
FT_JTAG_TDI
  Top 0.152: IC3.17 71.13,58.88 79.93,67.69 J2.5
FT_JTAG_TDO
  Top 0.152: IC3.18 70.09,59.38 77.39,66.69 J2.3
FT_JTAG_TMS
  Top 0.152: IC3.19 69.05,59.88 74.85,65.69 J2.1
GND  (via drill 0.35, 0.4)
  Top 0.254: U$3.P$10 49.16,24.27 U$3.P$8
  other vias: 37.93,58.99 48.53,73.69 40.93,62.39 54.63,74.29 57.76,47.4 52.43,34.9
  pour Top: 375 corners
  pour Bottom: 370 corners
JTAG_CLK  (via drill 0.4)
  Top 0.2: R23.2 80.97,78.49 v80.23,78.49 | v45.93,84.59 45.93,85.74 45.88,85.8 45.88,92.84 46.8,93.76 U2.16
  Bottom 0.2: v80.23,78.49 78.93,77.19 53.33,77.19 v45.93,84.59
JTAG_TDI
  Top 0.2: R25.2 78.73,75.69 78.73,72.29 78.03,71.59 73.93,71.59 65.83,79.69 42.53,79.69 40.25,81.97 40.25,94.53 U2.14
JTAG_TDO_LED1  (via drill 0.4)
  Top 0.2: U2.23 55.7,94.24 v54.66,93.21 | v75.43,80.09 75.93,79.59 75.93,77.89 76.93,76.89 R24.2
  Bottom 0.2: v54.66,93.21 56.18,91.69 63.83,91.69 v75.43,80.09
JTAG_TMS
  Top 0.2: R26.2 71.03,80.69 43.03,80.69 41.23,82.49 41.23,93.49 43.63,95.89 43.63,97.09 42.93,97.8 U2.13
N$5
  Top 0.2: CL2.C CL1.A 38.95,23.17 40.13,21.99 40.13,19.49 36.93,16.29 26.78,16.29 26.37,16.7 IC-IP5305.LED1
N$6
  Top 0.152: R5.2 56.3,54.52 55.33,55.49 55.33,56.85 IC3.14
N$7
  Top 0.152: R6.1 51.04,43.93 51.24,44.13 51.24,56.85 IC3.6
N$8
  Top 0.203: IC4.1 35.41,56.92 R9.1 37.07,60.66 R10.1
N$11
  Top 0.203: RX-LED.A 36.92,71.35 R11.1
N$13
  Top 0.203: TX-LED.A 34.6,69.55 R12.1
N$14
  Top 0.2: IC-IP5305.LED2 27.64,18.24 | CL4.C CL3.A
  Top 0.254: CL4.C 31.28,22.77 29.13,20.61 29.13,19.73 27.64,18.24
N$15
  Top 0.2: CL4.A 31.3,20.17 CL3.C CL2.A CL1.C
  Top 0.254: IC-IP5305.LED3 29.9,17.84 31.3,19.24 31.3,20.17
N$16
  Top 0.254: R2.2 23.34,12.84 C22.2
N$17
  Top 0.2: IC-IP5305.SW 26.37,25.35 25.23,26.48 25.23,28.01
  Top 0.254: 25.23,28.01 L1.2
N$18
  Top 0.2: IC3.9 52.79,47.84 C19.1 54.09,44.01 | 54.09,44.01 C18.1 | EMIFILTER2.3 54.08,43.99 54.09,44.01
N$19
  Top 0.152: IC3.4 50.29,54.84 50.93,54.19 50.93,45.55 C20.1 49.11,41.39 C21.1 49.13,41.26 49.13,39.59 48.3,38.75 EMIFILTER1.3
N$20
  Top 0.2: J3.2 17.15,25.15 21.23,29.23 C25.1 24.34,31.04 27.22,31.04 28.06,30.2 L1.1 27.64,27.62 IC-IP5305.BAT
N$21
  Top 0.152: R3.1 29.99,25.55 29.99,25.39
  Top 0.2: R17.1 31.68,25.39 29.99,25.39 28.91,24.31 IC-IP5305.KEY
N$24
  Top 0.2: R3.2 31.93,32.77 KEYLED.A
N$25
  Top 0.2: R17.2 36.37,26.7 U$5.P$2
N$27  (via drill 0.6)
  Top 0.2: IC-IP5305.VOUT 24.8,22.84 C24.2
  Top 0.254: C24.2 C23.2 21.03,22.99 v21.03,25.99 | v60.43,19.69 63.65,19.69 RESETTABLE_FUSE.1
  Bottom 0.254: v21.03,25.99 30.53,25.99 33.63,29.09 56.43,29.09 57.93,27.59 57.93,22.19 v60.43,19.69
N$31
  Top 0.152: U$1.9 13.07,79.53 15.94,82.4 R14.1
N$32
  Top 0.152: U$1.7 16.77,80.99 18.13,80.99 18.75,81.6 R13.1
OSCI
  Top 0.152: IC3.2 49.29,55.34 45.43,51.49 Y1.2 45.43,48.73 C6.1
OSCO
  Top 0.152: IC3.3 49.79,51.41 Y1.1 49.73,48.4 C7.1
PAIR_RX  (via drill 0.4)
  Top 0.152: U2.6 42.26,106.68 42.99,106.68 45.17,108.85 v45.17,110.57
  Bottom 0.152: v45.17,110.57 46.14,109.6 53.1,109.6 56.7,113.2 68.8,113.2 92.7,89.3 92.7,26.24 J1.2
PAIR_TX  (via drill 0.4)
  Top 0.152: U2.10 43.3,101.61 46.01,104.31 v46.01,108.05
  Bottom 0.152: v46.01,108.05 46.86,108.9 53.45,108.9 56.67,112.11 68.74,112.11 90.87,89.99 90.87,26.95 J1.3
PROG_RX  (via drill 0.4)
  Top 0.2: U2.34 57.63,107.95 v56.33,109.25 | v23.03,94.09 16.57,87.63 R14.2
  Bottom 0.2: v56.33,109.25 54.17,107.09 36.03,107.09 v23.03,94.09 22.98,94.03 J4.4
PROG_TX  (via drill 0.4)
  Top 0.2: U2.35 59.11,109.22 58.3,110.03 v58.3,110.97 | R13.2 18.75,88.1 v23.03,92.39
  Bottom 0.2: v58.3,110.97 58.3,109.94 54.35,105.99 36.63,105.99 v23.03,92.39 22.14,91.49 J4.5
PWREN  (via drill 0.4)
  Top 0.152: IC3.60 44.6,60.88 44.27,60.56 39.91,60.56 v39.48,60.99 | v33.12,65.3 29.06,69.37 U$1.1
  Bottom 0.2: v39.48,60.99 39.09,61.38 34.63,61.38 33.12,62.88 v33.12,65.3
PWRSAV
  Top 0.203: R16.2 46.13,31.75 | 46.13,31.75 45.12,31.75 R22.2 | 46.13,31.75 46.13,39.67 43.83,41.97 43.83,54.17 47.83,58.17 47.83,61.19 47.64,61.38 IC3.59
RXD_LED
  Top 0.203: IC3.54 39.43,63.88 RX-LED.C
RXD_SPI_PROM_MOSI  (via drill 0.4)
  Top 0.152: IC3.39 53.27,68.39 53.27,74.13 51.31,76.09 14.88,76.09 v14.88,76.23
  Bottom 0.152: v14.88,76.23 14.88,76.04 14.53,75.7 11.52,75.7 U$1.8
SCL
  Top 0.2: U2.36 65.03,110.5 R20.1 67.44,110.7 67.68,111.05 78.72,111.05 79.05,110.72 79.05,104.31 78.6,103.85 U$4.SCL
SCL-2
  Top 0.152: U2.24 57,95 57,93 57.88,92.12 R28.2 48.27,92.12 47.07,90.92 TOP-BOT-CONNECTOR.4
SD_CS
  Top 0.152: U$10.15 84.44,49.62 84.44,81.08
  Top 0.2: U2.29 63.92,101.61 84.44,81.08
SDA
  Top 0.2: U2.33 65.84,106.69 R19.2 67.93,104.59 68.53,104.59 71.48,101.64 76.66,101.64 76.67,101.63 U$4.SDA
SDA-2
  Top 0.152: TOP-BOT-CONNECTOR.6 49.61,89.77 50.68,90.84 58.49,90.84 59.4,89.93 R29.2 60.25,89.7 60.25,93.71 59.91,94.05 59.06,94.05 58.5,94.61 58.5,98.76 58.8,99.06 U2.27
SPI_PROM_CS
  Top 0.152: IC3.41 52.27,68.39 52.27,73.57 51.42,74.42 35.5,74.42 35.07,73.99 33.13,73.99 29.73,70.59 11.53,70.59 10.23,71.89 U$1.4
SPI_PROM_MISO
  Top 0.152: IC3.40 52.77,68.39 52.77,73.9 51.05,75.61 12.29,75.61 11.12,74.45 U$1.6
SUSPEND  (via drill 0.4)
  Top 0.152: IC3.36 54.79,69.42 54.95,69.58 57.99,69.58 58.51,70.11 58.51,71.75 53.07,77.19 18.82,77.19 v17.93,78.08
  Bottom 0.152: v17.93,78.08 17.93,76.98 12.85,71.91 U$1.3
SVN  (via drill 0.4)
  Top 0.2: R21.1 47.3,86.06 TOP-BOT-CONNECTOR.3
  Top 0.254: U2.5 39.39,107.95 34.95,103.51 34.95,83.99 40.43,78.51 v55.46,78.51
  Bottom 0.254: v55.46,78.51 53.26,78.51 47.07,84.7 TOP-BOT-CONNECTOR.3
SVP  (via drill 0.4)
  Top 0.2: R27.1 49.74,86.16 TOP-BOT-CONNECTOR.5
  Top 0.254: U2.4 39.05,109.22 34.01,104.19 34.01,83.54 39.8,77.75 54.11,77.75 54.88,76.98 56.94,76.98 v58.2,78.24
  Bottom 0.254: v58.2,78.24 55.1,81.34 54.56,81.34 TOP-BOT-CONNECTOR.5
TOUCH_CLK  (via drill 0.4)
  Top 0.2: U$10.10 22.13,50.12 v22.13,61.99 | v37.22,96.9 37.13,96.99 40.48,100.33 U2.11
  Bottom 0.2: v22.13,61.99 23.15,63.01 24.68,63.01 28.03,66.36 28.03,87.79 37.15,96.9 v37.22,96.9
TOUCH_CS  (via drill 0.4)
  Top 0.2: U$10.11 23.13,48.58 v23.13,63.99 | v40.13,98.99 42.17,98.99
  Top 0.254: 42.17,98.99 U2.12
  Bottom 0.2: v23.13,63.99 23.16,63.96 24.74,63.96 27.13,66.36 27.13,87.99 38.13,98.99 v40.13,98.99
TOUCH_DATA_IN  (via drill 0.4)
  Top 0.2: U$10.12 24.13,47.04 v24.13,65.99 | U2.9 36.53,102.88 v36.48,102.83
  Bottom 0.2: v24.13,65.99 24.13,90.48 v36.48,102.83
TOUCH_DATA_OUT  (via drill 0.4)
  Top 0.2: U$10.13 25.13,45.5 v25.13,67.99 | U2.7 39.82,105.42 v38.51,104.1
  Bottom 0.2: v25.13,67.99 25.13,90.09 38.51,103.46 v38.51,104.1
TOUCH_IRQ  (via drill 0.4)
  Top 0.2: U$10.14 26.13,43.96 v26.13,66.99 | 40.49,104.14 U2.8
  Top 0.254: v40.33,103.99 40.49,104.14
  Bottom 0.2: v26.13,66.99 26.13,89.69 40.33,103.89 v40.33,103.99
TXD_LED
  Top 0.203: IC3.55 37.52,63.38 TX-LED.C
TXD_SPI_PROM_CLK  (via drill 0.4)
  Top 0.152: IC3.38 53.77,68.39 53.77,74.47 51.54,76.69 17.13,76.69 16.89,76.94 v16.89,78.06
  Bottom 0.152: v16.89,78.06 16.69,78.26 11.5,78.26 U$1.10
USB_DM
  Top 0.152: IC3.7 51.79,38.99 53.75,37.02 U$2.P1 54.15,36.33 54.53,35.95 54.53,33.09 50.54,29.09 U$3.D-
USB_DP
  Top 0.152: U$3.D+ 51.19,28.99 55.43,33.24 55.43,35.89 55.93,36.39 56.25,36.39 | IC3.8 52.33,56.85 52.33,39.49 53.58,38.24 55.38,38.24 56.25,37.37 56.25,36.39 | 56.25,36.39 U$2.P6
VBAT
  Top 0.254: RESETTABLE_FUSE.2 70.11,19.25 C4.1 70.75,18.79 IC2.4 73.46,16.48 PWR.A1
VCC  (via drill 0.35, 0.4)
  Top 0.152: v4.13,50.99 5.43,52.29 R15.1 | v4.13,50.99 6.43,48.69 6.43,42.67 R18.1 | v4.13,50.99 4.13,54.98 U$10.1 | v4.13,50.99 3.63,50.99 3.33,51.29 3.33,55.09 8.33,60.09 8.33,80.17 10.14,81.98 U$1.12 | C1.1 39.63,111.8 42.21,111.8 U2.2 | R28.1 v66.12,92.13 66.12,90.63 64.34,88.85 R29.1
  Top 0.2: v33.73,112.69 33.83,112.69 34.33,113.19 38.63,113.19 39.63,112.19 39.63,111.8 | R4.2 10.14,87.89 10.14,81.98 | C5.1 73.56,26.51 84.73,37.69 v89.03,37.69 | R20.2 70.44,106.88 | 70.44,106.88 v70.44,104.55 69.78,104.55 R19.1 | U$4.VCC 77.03,106.39 76.43,106.99 76.43,108.74 C35.1 76.17,108.96 72.52,108.96 70.44,106.88 | R1.2 87.71,94.27 v84.53,91.09 | R21.2 44.13,82.31 42.39,84.05 42.39,86.69 TOP-BOT-CONNECTOR.2 42.29,88.83 41.85,88.38 41.85,83.22 43.66,81.4 49.29,81.4 R27.2
  Top 0.203: IC2.1 73.46,25.25 C5.1 62.06,36.84 v61.18,36.84 | EMIFILTER1.1 48.3,33.93 v48.33,33.89 | v61.18,36.84 57.3,40.72 EMIFILTER2.1 | v61.18,36.84 61.13,36.89 61.13,47.6 57.43,51.3 R5.1 | v61.18,36.84 61.18,40.44 62.95,42.21 v62.95,55.79 | IC3.20 60.07,60.38 C15.1 60.72,60.69 62.53,60.69 64.33,62.49 v64.33,72.89 60.55,69.11 C14.1 60.51,65.88 IC3.31 | v41.33,72.89 42.25,71.97 C8.1 42.59,65.88 IC3.50 | R11.2 37.27,72.89 v41.33,72.89 | v41.33,72.89 40.13,74.09 35.63,74.09 34.73,73.19 R12.2 | R8.1 29.23,60.07 29.23,61.09 30.13,61.99 33.67,61.99 v34.57,62.89 | v34.57,62.89 30.03,62.89 28.13,60.99 28.13,58.59 28.62,58.1 R7.2 | v34.57,62.89 35.57,61.89 37.63,61.89 38.73,60.79 38.73,57.06 R9.2 | v34.57,62.89 38.93,62.89 40.93,60.89 44.13,60.89 44.47,61.23 C11.1 44.47,62.23 45.13,62.89 45.14,62.88 IC3.56 | v34.57,62.89 33.57,63.89 29.83,63.89 27.53,61.59 27.53,57.39 28.33,56.59 29.83,56.59 30.39,56.03 C3.1 32.6,56.99 IC4.6 | v41.33,72.89 47.33,72.89 49.43,70.79 49.44,70.8 C16.1 51.79,69.83 IC3.42
  Bottom 0.152: v48.33,33.89 46.23,31.79 17.33,31.79 12.23,26.69 9.43,26.69 7.33,28.79 7.33,47.79 v4.13,50.99 | v70.44,104.55 70.44,96.45 v66.12,92.13
  Bottom 0.2: v33.73,112.69 20.83,112.69 10.23,102.08 U$1.12 10.23,85.4 J4.6 | v70.44,104.55 71.08,104.55 v84.53,91.09 84.53,89.09 89.03,84.59 v89.03,37.69
  Bottom 0.203: v48.33,33.89 58.23,33.89 v61.18,36.84 | v62.95,55.79 62.95,71.51 v64.33,72.89 v41.33,72.89 | v41.33,72.89 41.43,72.99 41.43,85.99 44.27,88.83 TOP-BOT-CONNECTOR.2 | v34.57,62.89 41.33,69.65 v41.33,72.89
VCC1.8  (via drill 0.4)
  Top 0.152: 54.29,54.24 C12.1
  Top 0.2: 44.63,58.06 C10.1
  Top 0.203: IC3.12 54.29,54.24 | IC3.37 54.29,70.24 54.71,70.66 C17.1 57.46,70.66 v57.63,70.49 | IC3.49 45.08,68.1 C9.1 46.72,68.1 51.67,63.15 v51.67,61.93 | IC3.64 45.97,58.06 44.63,58.06 44.63,56.59 v42.68,54.64 | v56.54,50.62 55.93,51.23 55.93,53.18 54.98,54.14 C12.1
  Bottom 0.203: v51.67,61.93 51.67,63.13 57.63,69.09 v57.63,70.49 | v51.67,61.93 44.38,54.64 v42.68,54.64 | v51.67,61.93 51.67,55.49 v56.54,50.62
VCC5V
  Top 0.254: R16.1 49.89,31.28 U$3.+5V 49.89,27.3 49.89,26.57 49.23,25.92 47.05,25.92 45.93,24.8 45.93,24.13 35.04,13.23 27.67,13.23 R2.1 24.92,15.19 C13.2 23.23,15.97 IC-IP5305.VIN

### Text on the board
tNames: VCC | SCL | SDA | IO1 | IO2 | GND | VBAT | GND | VCC | NC | TXD SPI / PROMCLK | Prog_RX | Jumper to use / usb to program | Prog_TX | RXD SPI / PROMMOSI | SPI PROM / MISO | NC | SUSPEND | SPI PROM / CS | Jumper all 4 / for jtag via usb | GND | PWREN | TMS | TDO | TDI | CLK | GND | 100 % | TX | 0 % | RX | GND | PAIRING
bNames: Greetings Agent. / Can you solve my / Challenge?
Document: Pick and placed components should be on the top layer of this board